# Altium project lps_display_rev_g.PrjPcb
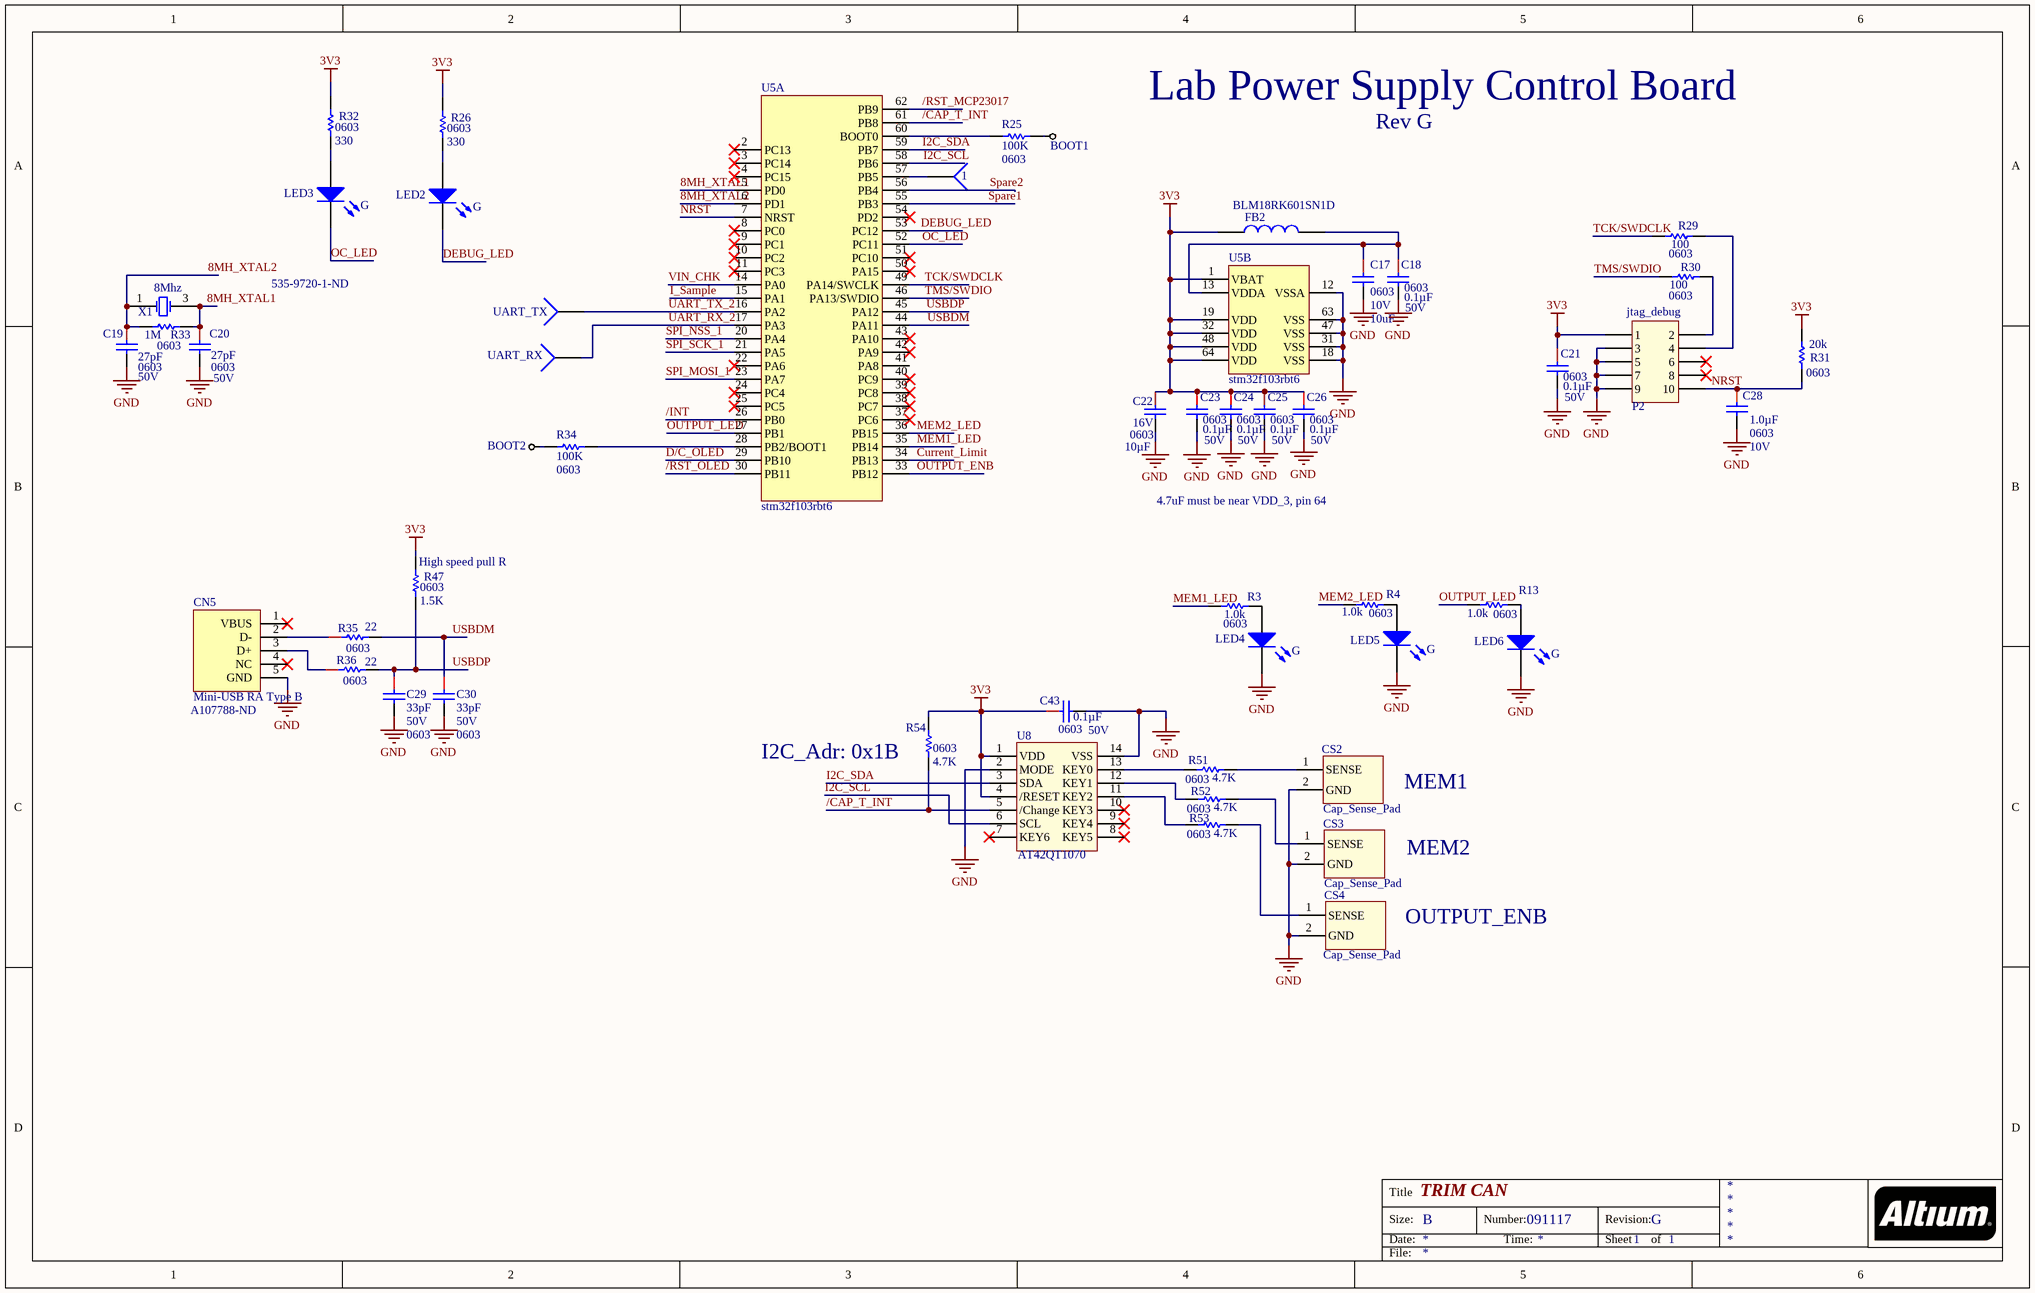
[diagram p0: lps_display_rev_g_p2.SchDoc]
1 sheet, 51 parts. Net scope: global (net labels, ports and power ports of the same name join across sheets).
Board file: lps_display_rev_g.PcbDoc

## Sheet lps_display_rev_g_p2.SchDoc: TRIM CAN
size B; Author: JO; DrawnBy: JO; Engineer: JO; DocumentNumber: 091117; Revision: G; SheetNumber: 1; SheetTotal: 1; PageSetup: Record=PageOptions|CenterHorizontal=True|CenterVertical=True|PrintScale=0.95|XCorrection=1.00|YCorrection=1.00|PrintKind=1|BorderSize=5000000|LeftOffset=0|BottomOffset=0|Orientation=2|PaperLength=1000|PaperWidth=1000|Scale=100|PaperSource=7|PrintQuality=-4|MediaType=1|DitherType=10|PaperKind=Letter|PrintScaleMode=1; DocumentName: TRIM CAN

### Parts
1  (no value)  [TestPoint-TH 35 mil]  (no BOM)
BOOT1  TP  [TestPoint-TH 40 mil]  (value not drawn)
BOOT2  TP  [TestPoint-TH 40 mil]  (value not drawn)
C17  Package / Case: 0603  Voltage - Rated: 10V  Capacitance: 10uF  [CAPC0603(1608)_N]  (hidden comment: CAP 10UF 10V 10% X5R 0603)
C18  Package / Case: 0603  Capacitance: 0.1µF  Voltage - Rated: 50V  [CAPC0603(1608)_N]  (hidden comment: 0.1uF 0603 50V)
C19  Voltage - Rated: 50V  Package / Case: 0603  Capacitance: 27pF  [CAPC0603(1608)_L]  (hidden comment: 27pF 0603)
C20  Voltage - Rated: 50V  Package / Case: 0603  Capacitance: 27pF  [CAPC0603(1608)_L]  (hidden comment: 27pF 0603)
C21  Package / Case: 0603  Capacitance: 0.1µF  Voltage - Rated: 50V  [CAPC0603(1608)_N]  (hidden comment: 0.1uF 0603 50V)
C22  Voltage - Rated: 16V  Package / Case: 0603  Capacitance: 10µF  [CAPC0603(1608)_M]  (hidden comment: 4.7UF 0603)
C23  Package / Case: 0603  Capacitance: 0.1µF  Voltage - Rated: 50V  [CAPC0603(1608)_N]  (hidden comment: 0.1uF 0603 50V)
C24  Package / Case: 0603  Capacitance: 0.1µF  Voltage - Rated: 50V  [CAPC0603(1608)_N]  (hidden comment: 0.1uF 0603 50V)
C25  Package / Case: 0603  Capacitance: 0.1µF  Voltage - Rated: 50V  [CAPC0603(1608)_N]  (hidden comment: 0.1uF 0603 50V)
C26  Package / Case: 0603  Capacitance: 0.1µF  Voltage - Rated: 50V  [CAPC0603(1608)_N]  (hidden comment: 0.1uF 0603 50V)
C28  Capacitance: 1.0µF  Package / Case: 0603  Voltage - Rated: 10V  [CAPC0603(1608)_N]  (hidden comment: 1uF)
C29  33pF  Voltage (Rated): 50V  Package (Imperial): 0603  [CAPC0603(1608)_M]
C30  33pF  Voltage (Rated): 50V  Package (Imperial): 0603  [CAPC0603(1608)_M]
C43  Package / Case: 0603  Capacitance: 0.1µF  Voltage - Rated: 50V  [CAPC0603(1608)_N]  (hidden comment: 0.1uF 0603 50V)
CN5  Mini-USB RA Type B  [USB-MINI-B - 2A]
CS2  Cap_Sense_Pad  [CAP_TOUCH_ROUND]
CS3  Cap_Sense_Pad  [CAP_TOUCH_ROUND]
CS4  Cap_Sense_Pad  [CAP_TOUCH_ROUND]
FB2  BLM18RK601SN1D  [RESC0603(1608)_N]
LED2  G  [SM-LED-0603]
LED3  G  [SM-LED-0603]
LED4  G  [SM-LED-0603]
LED5  G  [SM-LED-0603]
LED6  G  [SM-LED-0603]
P2  jtag_debug  [jtag_debug]
R3  Package / Case: 0603  [RESC0603(1608)_N]  (hidden comment: 1.0K)
R4  Package / Case: 0603  [RESC0603(1608)_N]  (hidden comment: 1.0K)
R13  Package / Case: 0603  [RESC0603(1608)_N]  (hidden comment: 1.0K)
R25  100K  Supplier Device Package: 0603  [RESC0603(1608)_N]
R26  Package / Case: 0603  Resistance (Ohms): 330  [RESC0603(1608)_N]  (hidden comment: 1.0K)
R29  Package / Case: 0603  [RESC0603(1608)_N]  (hidden comment: 100)
R30  Package / Case: 0603  [RESC0603(1608)_N]  (hidden comment: 100)
R31  Resistance (Ohms): 20k  Package / Case: 0603  [RESC0603(1608)_N]  (hidden comment: 10K 1%)
R32  Package / Case: 0603  Resistance (Ohms): 330  [RESC0603(1608)_N]  (hidden comment: 1.0K)
R33  Package / Case: 0603  [RESC0603(1608)_N]  (hidden comment: 1M)
R34  100K  Supplier Device Package: 0603  [RESC0603(1608)_N]
R35  Package (Imperial): 0603  [RESC0603(1608)_M]  (hidden comment: 22)
R36  Package (Imperial): 0603  [RESC0603(1608)_M]  (hidden comment: 22)
R47  Package / Case: 0603  Resistance (Ohms): 1.5K  [RESC0603(1608)_M]  (hidden comment: 1.0K)
R51  Package / Case: 0603  Resistance (Ohms): 4.7K  [RESC0603(1608)_M]  (hidden comment: 1.0K)
R52  Package / Case: 0603  Resistance (Ohms): 4.7K  [RESC0603(1608)_M]  (hidden comment: 1.0K)
R53  Package / Case: 0603  Resistance (Ohms): 4.7K  [RESC0603(1608)_M]  (hidden comment: 1.0K)
R54  Package / Case: 0603  Resistance (Ohms): 4.7K  [RESC0603(1608)_M]  (hidden comment: 1.0K)
U5  stm32f103rbt6  [LQFP64]  (parts A,B of 2)
U8  AT42QT1070  [SOP14]
UART_RX  (no value)  [TestPoint-TH 35 mil]  (no BOM)
UART_TX  (no value)  [TestPoint-TH 35 mil]  (no BOM)
X1  8Mhz  [SMXOSC/5x3.2]

### Nets
3V3: C21.1 C22.1 C23.1 C24.1 C25.1 C26.1 C43.1 FB2.1 P2.1 R26.2 R31.1 R32.2 R47.2 R54.1 U5.1(VBAT) U5.19(VDD) U5.32(VDD) U5.48(VDD) U5.64(VDD) U8.1(VDD) U8.4(/RESET)
GND: C17.2 C18.2 C19.2 C20.2 C21.2 C22.2 C23.2 C24.2 C25.2 C26.2 C28.2 C29.2 C30.2 C43.2 CN5.0(GND) CN5.5(GND) CS2.2(GND) CS3.2(GND) CS4.2(GND) LED4.2 LED5.2 LED6.2 P2.2(3) P2.5 P2.7 P2.9 U5.12(VSSA) U5.18(VSS) U5.31(VSS) U5.47(VSS) U5.63(VSS) U8.2(MODE) U8.14(VSS)
8MH_XTAL1: C20.1 R33.1 U5.5(PD0) X1.3(OSC2)
8MH_XTAL2: C19.1 R33.2 U5.6(PD1) X1.1(OSC1)
/CAP_T_INT: R54.2 U5.61(PB8) U8.5(/Change)
/INT: U5.26(PB0)
/RST_MCP23017: U5.62(PB9)
/RST_OLED: U5.30(PB11)
Current_Limit: U5.34(PB13)
D/C_OLED: U5.29(PB10)
DEBUG_LED: LED2.2 U5.53(PC12)
I2C_SCL: U5.58(PB6) U8.6(SCL)
I2C_SDA: U5.59(PB7) U8.3(SDA)
I_Sample: U5.15(PA1)
MEM1_LED: R3.1 U5.35(PB14)
MEM2_LED: R4.1 U5.36(PB15)
NRST: C28.1 P2.10 R31.2 U5.7(NRST)
OC_LED: LED3.2 U5.52(PC11)
OUTPUT_ENB: U5.33(PB12)
OUTPUT_LED: R13.1 U5.27(PB1)
Spare1: U5.55(PB3)
Spare2: U5.56(PB4)
SPI_MOSI_1: U5.23(PA7)
SPI_NSS_1: U5.20(PA4)
SPI_SCK_1: U5.21(PA5)
TCK/SWDCLK: R29.2 U5.49(PA14/SWCLK)
TMS/SWDIO: R30.2 U5.46(PA13/SWDIO)
UART_RX_2: U5.17(PA3) UART_RX.1
UART_TX_2: U5.16(PA2) UART_TX.1
USBDM: C30.1 R35.2 U5.44(PA11)
USBDP: C29.1 R36.2 R47.1 U5.45(PA12)
VIN_CHK: U5.14(PA0)
Net1_1: 1.1 U5.57(PB5)
NetBOOT1_1: BOOT1.1 R25.1
NetBOOT2_1: BOOT2.1 R34.2
NetC17_1: C17.1 C18.1 FB2.2 U5.13(VDDA)
NetCN5_2: CN5.2(D-) R35.1
NetCN5_3: CN5.3(D+) R36.1
NetCS2_1: CS2.1(SENSE) R51.1
NetCS3_1: CS3.1(SENSE) R52.1
NetCS4_1: CS4.1(SENSE) R53.1
NetLED2_1: LED2.1 R26.1
NetLED3_1: LED3.1 R32.1
NetLED4_1: LED4.1 R3.2
NetLED5_1: LED5.1 R4.2
NetLED6_1: LED6.1 R13.2
NetP2_2: P2.2 R30.1
NetP2_4: P2.4 R29.1
NetR25_2: R25.2 U5.60(BOOT0)
NetR34_1: R34.1 U5.28(PB2/BOOT1)
NetR51_2: R51.2 U8.13(KEY0)
NetR52_2: R52.2 U8.12(KEY1)
NetR53_2: R53.2 U8.11(KEY2)

Not connected (* = marked no-connect by the designer): CN5 1(VBUS)* 4(NC)*; P2 6* 8*; U5 2(PC13)* 3(PC14)* 4(PC15)* 8(PC0)* 9(PC1)* 10(PC2)* 11(PC3)* 22(PA6)* 24(PC4)* 25(PC5)* 37(PC6)* 38(PC7)* 39(PC8)* 40(PC9)* 41(PA8) 42(PA9)* 43(PA10)* 50(PA15)* 51(PC10)* 54(PD2)*; U8 7(KEY6)* 8(KEY5)* 9(KEY4)* 10(KEY3)*; X1 2(NC) 4(NC)

### Notes on the sheet
- Lab Power Supply Control Board
- Rev G
- 535-9720-1-ND
- 4.7uF must be near VDD_3, pin 64
- (near R47) High speed pull R
- (near CN5) A107788-ND
- (near R54) I2C_Adr: 0x1B
- MEM1
- MEM2
- OUTPUT_ENB
- Title
- Size:
- Date:
- B
- Number:
- Time:
- Revision:
- Sheet
- of
- File:

### Library data of the parts
1 UART_RX UART_TX = TestPoint: Test Point
BOOT1 BOOT2 = TestPoint-PC-W: Test Point White; Manufacturer: Keystone Electronics; Manufacturer Part Number: 5002; Plating: Silver; Material - Insulation: Nylon 46, UL 94V-0; Material - Body: Phosphor Bronze; Supplier 1: Digi-Key; RoHS: RoHS Compliant; Category: Test and Measurement; Stock 1: 329102; Pricing 1: 1=0.37, 10=0.316, 50=0.2298, 100=0.2209, 250=0.19832, 1000=0.1616, 2500=0.14424, 5000=0.13523 (USD); Packaging: Bulk; Part Status: Active; Type: PC Test Point, Miniature; Mounting Type: 0.040" (1.02mm) Hole Diameter; Color: White; Size / Dimension: 0.100" Dia x 0.180" L (2.54mm x 4.57mm); Height: -; ComponentLink1URL: http://www.keyelco.com/product-pdf.cfm?p=1311; ComponentLink1Description: http://www.keyelco.com/product-pdf.cfm?p=1311; Supplier Part Number 1: 36-5002-ND
C17 = CAP CER 10UF 10V 10% X5R 0603: 10uF 0603; Manufacturer: Samsung Electro-Mechanics America, Inc; Manufacturer Part Number: CL10A106KP8NNNC; ClassName: *; Supplier 1: Digi-Key; RoHS: RoHS Compliant; Category: Capacitors; Stock 1: 157585; Pricing 1: 1=0.48, 10=0.42, 25=0.3, 100=0.21, 500=0.153, 1000=0.138 (USD); Packaging: Cut Tape (CT); Tolerance: ±10%; Temperature Coefficient: X5R; Mounting Type: Surface Mount, MLCC; Operating Temperature: -55°C ~ 85°C; Applications: General Purpose; Ratings: -; Size / Dimension: 0.063" L x 0.031" W (1.60mm x 0.80mm); Height - Seated (Max): -; Thickness (Max): 0.035" (0.90mm); Lead Spacing: -; Features: -; Lead Style: -; ComponentLink1URL: http://www.samsungsem.com/kr/front/downloadcms.do?path=/kr/support/product-search/mlcc/__icsFiles/afieldfile/2014/11/05&fileName=S_CL10A106KP8NNNC.pdf; ComponentLink1Description: http://www.samsungsem.com/kr/front/downloadcms.do?path=/kr/support/product-search/mlcc/__icsFiles/afieldfile/2014/11/05&fileName=S_CL10A106KP8NNNC.pdf; Supplier Part Number 1: 1276-1192-1-ND
C18 C21 C23-C26 C43 = CAP CER 0.1UF 50V 10% X7R 0603: Manufacturer: Yageo; Manufacturer Part Number: CC0603ZRY5V9BB104; Tolerance: -20%, +80%; Temperature Coefficient: Y5V (F); ClassName: *; Supplier 1: Digi-Key; RoHS: RoHS Compliant; Category: Capacitors; Stock 1: 2192156; Pricing 1: 1=0.1, 10=0.019, 100=0.0087, 500=0.0062, 1000=0.00487 (USD); Packaging: Cut Tape (CT); Part Status: Active; Operating Temperature: -30°C ~ 85°C; Features: -; Ratings: -; Applications: General Purpose; Failure Rate: -; Mounting Type: Surface Mount, MLCC; Size / Dimension: 0.063" L x 0.031" W (1.60mm x 0.80mm); Height - Seated (Max): -; Thickness (Max): 0.035" (0.90mm); Lead Spacing: -; Lead Style: -; ComponentLink1URL: http://www.yageo.com/documents/recent/UPY-GPHC_Y5V_6.3V-to-50V_8.pdf; ComponentLink1Description: http://www.yageo.com/documents/recent/UPY-GPHC_Y5V_6.3V-to-50V_8.pdf; Supplier Part Number 1: 311-1343-1-ND
C19 C20 = CAP CER 27PF 50V 1% NP0 0603: Manufacturer: Kemet; Manufacturer Part Number: C0603C270F5GACTU; Tolerance: ±1%; Temperature Coefficient: C0G, NP0; Supplier 1: Digi-Key; RoHS: RoHS Compliant; Category: Capacitors; Stock 1: 27319; Pricing 1: 1=0.94, 10=0.795, 25=0.6596, 50=0.5848, 100=0.4648, 250=0.38984, 1000=0.31605 (USD); Packaging: Cut Tape (CT); Mounting Type: Surface Mount, MLCC; Operating Temperature: -55°C ~ 125°C; Applications: General Purpose; Ratings: -; Size / Dimension: 0.063" L x 0.031" W (1.60mm x 0.80mm); Height - Seated (Max): -; Thickness (Max): 0.034" (0.87mm); Lead Spacing: -; Features: -; Lead Style: -; ComponentLink1URL: http://www.kemet.com/docfinder?Partnumber=C0603C270F5GACTU; ComponentLink1Description: http://www.kemet.com/docfinder?Partnumber=C0603C270F5GACTU; Supplier Part Number 1: 399-7888-1-ND
C22 = CAP CER 4.7UF 16V 10% X5R 0603: Manufacturer: Taiyo Yuden; Manufacturer Part Number: EMK107ABJ475KA-T; Tolerance: ±10%; Temperature Coefficient: X5R; ClassName: *; Supplier 1: Digi-Key; RoHS: RoHS Compliant; Category: Capacitors; Stock 1: 498907; Pricing 1: 1=0.26, 10=0.216, 50=0.1216, 100=0.108, 250=0.081, 500=0.07154, 1000=0.06345 (USD); Packaging: Cut Tape (CT); Mounting Type: Surface Mount, MLCC; Operating Temperature: -55°C ~ 85°C; Applications: General Purpose; Ratings: -; Size / Dimension: 0.063" L x 0.031" W (1.60mm x 0.80mm); Height - Seated (Max): -; Thickness (Max): 0.035" (0.90mm); Lead Spacing: -; Features: -; Lead Style: -; ComponentLink1URL: http://www.yuden.co.jp/or/product/category/capacitor/EMK107ABJ475KA-T.pdf; ComponentLink1Description: http://www.yuden.co.jp/or/product/category/capacitor/EMK107ABJ475KA-T.pdf; Supplier Part Number 1: 587-2786-1-ND
C28 = CAP CER 1UF 10V 10% X5R 0603: 1uF 0603 10V; Manufacturer: Kemet; Manufacturer Part Number: C0603C105K8PACTU; Tolerance: ±10%; Temperature Coefficient: X5R; Supplier 1: Digi-Key; RoHS: RoHS Compliant; Category: Capacitors; Stock 1: 1121198; Pricing 1: 1=0.1, 10=0.043, 25=0.0304, 50=0.0232, 100=0.0196, 250=0.01608, 1000=0.0105 (USD); Packaging: Cut Tape (CT); Mounting Type: Surface Mount, MLCC; Operating Temperature: -55°C ~ 85°C; Applications: General Purpose; Ratings: -; Size / Dimension: 0.063" L x 0.031" W (1.60mm x 0.80mm); Height - Seated (Max): -; Thickness (Max): 0.035" (0.90mm); Lead Spacing: -; Features: -; Lead Style: -; ComponentLink1URL: http://www.kemet.com/datasheets&C0603C105K8PACTU; ComponentLink1Description: http://www.kemet.com/datasheets&C0603C105K8PACTU; Supplier Part Number 1: 399-3118-1-ND
C29 C30 = CMP-007-0143-08: CAP CER 33PF 50V 5% NP0 0603; Dielectric Material: Ceramic; Package (Metric): 1608; Temperature Coefficient: C0G, NP0; Tolerance: 5%; Mounting Type: SMD; Capacitance: 33pF
CN5 = CMP-001-0449-01: Mini-USB RA Type B 2A; Manufacturer Part Number: 54-00019; Manufacturer: Tensility International Corp; Mating Cycles: 5000; Gender: Receptacle; Number of Contacts: 5; Number of Ports: 1; Voltage - Rated: 30VDC; Connector Type: USB - mini B; Shielding: Unshielded; Features: Board Guide; ComponentLink1Description: http://www.tensility.com/pdffiles/54-00019.pdf; Component Name: Mini-USB RA Type B 2A 54-00019; RoHS: RoHS Compliant; Designator: Mini-USB RA Type B 2A 54-00019; Mounting Type: Through Hole, Right Angle; Operating Temperature: -10°C ~ 60°C; Pin Count: 6; Mounting Feature: Horizontal; Supplier Link 2: https://www.arrow.com/en/products/54-00019/tensility-international; Ingress Protection: -; Contact Finish: Gold; Insulation Color: Black; Current Rating: 2A; Pricing 1: 50=0.6202 (USD); Stock 1: 0; Specifications: -; Termination: Solder; Packaging: Tube; Material Flammability Rating: -; Part Status: Active; Shell/Shielding Material: Phosphor Bronze; ComponentLink1URL: http://www.tensility.com/pdffiles/54-00019.pdf
FB2 = FERRITE BEAD 120 OHM 0603 1LN: FERRITE 120 OHM 0603 500mA; Manufacturer: TDK Corporation; Manufacturer Part Number: MMZ1608R121ATA00; Filter Type: Signal Line; Number of Lines: 1; Impedance @ Frequency: 120 Ohm @ 100MHz; DC Resistance (DCR) (Max): 180 mOhm; ClassName: *; Creator: *; Supplier 1: Digi-Key; RoHS: RoHS Compliant; Category: Filters; Stock 1: 21122; Pricing 1: 1=0.1, 10=0.073, 100=0.0436, 250=0.03168, 500=0.02904, 1000=0.02508 (USD); Packaging: Cut Tape (CT); Part Status: Active; Current Rating (Max): 500mA; Ratings: -; Operating Temperature: -55°C ~ 125°C; Package / Case: 0603 (1608 Metric); Mounting Type: Surface Mount; Height (Max): 0.037" (0.95mm); Size / Dimension: 0.063" L x 0.031" W (1.60mm x 0.80mm); ComponentLink1URL: https://product.tdk.com/info/en/catalog/datasheets/beads_commercial_signal_mmz1608_en.pdf; ComponentLink1Description: https://product.tdk.com/info/en/catalog/datasheets/beads_commercial_signal_mmz1608_en.pdf; Supplier Part Number 1: 445-2170-1-ND
LED2-LED6 = 0603 LED: 0603 SMD LED; PN: P11500CT-ND; Vendor: Digikey
R3 R4 R13 R26 R32 R47 R51-R54 = RES 1K OHM 1% 1/10W 0603: 1.0K 0603; Manufacturer: Stackpole Electronics Inc.; Manufacturer Part Number: RMCF0603FT1K00; Tolerance: ±1%; Power (Watts): 0.1W, 1/10W; Temperature Coefficient: ±100ppm/°C; Supplier 1: Digi-Key; RoHS: RoHS Compliant; Category: Resistors; Stock 1: 411308; Pricing 1: 1=0.1, 10=0.02, 100=0.0081, 1000=0.00364, 2500=0.00316 (USD); Packaging: Cut Tape (CT); Part Status: Active; Composition: Thick Film; Features: Automotive AEC-Q200; Operating Temperature: -55°C ~ 155°C; Size / Dimension: 0.061" L x 0.031" W (1.55mm x 0.80mm); Height - Seated (Max): 0.022" (0.55mm); Failure Rate: -; ComponentLink1URL: https://www.seielect.com/Catalog/SEI-RMCF_RMCP.pdf; ComponentLink1Description: https://www.seielect.com/Catalog/SEI-RMCF_RMCP.pdf; Supplier Part Number 1: RMCF0603FT1K00CT-ND; Supplier Device Package: 0603
  R3 R4 R13: Resistance (Ohms): 1.0k
R25 R34 = RES 100K OHM 1% 1/10W 0603: 100K 0603; Manufacturer: Yageo; Manufacturer Part Number: RC0603FR-07100KL; Tolerance: ±1%; Power (Watts): 0.1W, 1/10W; Temperature Coefficient: ±100ppm/°C; Supplier 1: Digi-Key; RoHS: RoHS Compliant; Category: Resistors; Stock 1: 13526613; Pricing 1: 1=0.1, 10=0.015, 100=0.006, 1000=0.00268, 2500=0.00233 (USD); Packaging: Cut Tape (CT); Part Status: Active; Composition: Thick Film; Features: Moisture Resistant; Operating Temperature: -55°C ~ 155°C; Package / Case: 0603 (1608 Metric); Size / Dimension: 0.063" L x 0.032" W (1.60mm x 0.80mm); Height - Seated (Max): 0.022" (0.55mm); Failure Rate: -; ComponentLink1URL: http://www.yageo.com/documents/recent/PYu-RC_Group_51_RoHS_L_8.pdf; ComponentLink1Description: http://www.yageo.com/documents/recent/PYu-RC_Group_51_RoHS_L_8.pdf; Supplier Part Number 1: 311-100KHRCT-ND
R29 R30 = RES 100 OHM 1% 1/10W 0603 2017: 100 0603; Manufacturer: Vishay Dale; Manufacturer Part Number: CRCW0603100RFKEC; Tolerance: ±1%; Power (Watts): 0.1W, 1/10W; Temperature Coefficient: ±100ppm/°C; Supplier 1: Digi-Key; RoHS: RoHS Compliant; Category: Resistors; Stock 1: 25979; Pricing 1: 1=0.1, 10=0.033, 100=0.0136, 1000=0.00609, 2500=0.00529, 5000=0.00437 (USD); Packaging: Cut Tape (CT); Part Status: Active; Resistance (Ohms): 100; Composition: Thick Film; Features: Automotive AEC-Q200; Operating Temperature: -55°C ~ 155°C; Supplier Device Package: 0603; Size / Dimension: 0.063" L x 0.033" W (1.60mm x 0.85mm); Height - Seated (Max): 0.020" (0.50mm); Failure Rate: -; ComponentLink1URL: http://www.vishay.com/docs/20035/dcrcwe3.pdf; ComponentLink1Description: http://www.vishay.com/docs/20035/dcrcwe3.pdf; Supplier Part Number 1: 541-2975-1-ND
R31 = RES 10K OHM 1/10W 1% 0603 SMD: 10K 0603; Manufacturer: Panasonic Electronic Components; Manufacturer Part Number: ERJ-3EKF1002V; Power (Watts): 0.1W, 1/10W; Temperature Coefficient: ±100ppm/°C; Category: Resistors; Supplier 1: Digi-Key; RoHS: RoHS Compliant; Stock 1: 5046430; Pricing 1: 1=0.1, 50=0.015, 100=0.0114, 250=0.00844, 500=0.00624, 1000=0.00416, 2500=0.00351 (USD); Packaging: Cut Tape (CT); Tolerance: ±1%; Composition: Thick Film; Features: -; Supplier Device Package: 0603; Size / Dimension: 0.063" L x 0.031" W (1.60mm x 0.80mm); Height: 0.022" (0.55mm); Number of Terminations: 2; ComponentLink1URL: http://industrial.panasonic.com/www-cgi/jvcr13pz.cgi?E+PZ+3+AOA0002+ERJ3EKF1002V+7+WW; ComponentLink1Description: http://industrial.panasonic.com/www-cgi/jvcr13pz.cgi?E+PZ+3+AOA0002+ERJ3EKF1002V+7+WW; Supplier Part Number 1: P10.0KHCT-ND
R33 = RES 1M OHM 1/10W 1% 0603: 1M 0603; Manufacturer: Yageo; Manufacturer Part Number: RC0603FR-071ML; Voltage Rating: 50V; Tolerance: ±1%; Power Rating: 100mW; Temperature Coefficient: 100ppm/°C; ComponentLink1URL: http://industrial.panasonic.com/www-cgi/jvcr13pz.cgi?E+PZ+3+AOA0002+ERJ3EKF1004V+7+WW; ComponentLink1Description: http://industrial.panasonic.com/www-cgi/jvcr13pz.cgi?E+PZ+3+AOA0002+ERJ3EKF1004V+7+WW; ComponentLink2URL: https://datasheet.ciiva.com/12555/rc0603-272842-12555388.pdf; ComponentLink2Description: https://datasheet.ciiva.com/12555/rc0603-272842-12555388.pdf; ComponentLink3URL: https://datasheet.ciiva.com/7983/443971-7983614.pdf; ComponentLink3Description: https://datasheet.ciiva.com/7983/443971-7983614.pdf; ComponentLink4URL: https://datasheet.ciiva.com/11819/0900766b80f96399-11819295.pdf; ComponentLink4Description: https://datasheet.ciiva.com/11819/0900766b80f96399-11819295.pdf; Supplier 1: Digi-Key; Supplier Part Number 1: 311-1.00MHRCT-ND; Stock 1: 2416528; Pricing 1: 1=0.1, 10=0.015, 100=0.006, 1000=0.0027, 2500=0.0023 (USD); Case/Package: 0603; Number of Pins: 2; Case Code (Imperial): 0603; Case Code (Metric): 1608; Min Operating Temperature: -55°C; Max Operating Temperature: 155°C; Resistance: 1M; Packaging: Tape and Reel; Package Quantity: 5000; Termination: SMD/SMT; Composition: Thick Film; Military Standard: Not; Length: 1.6mm; Height: 0.45mm; Width: 0.8mm; Depth: 0.8mm; REACH SVHC: No SVHC; Lead Free: Lead Free; Category: Resistors; Resistance (Ohms): 1M
R35 R36 = CMP-001-0711-04: Res Thick Film 0603 22 Ohm 5% 1/10W ±100ppm/C Molded SMD Paper T/R; Max Power Dissipation: 100mW; Package (Metric): 1608; Temperature Coefficient: 100ppm/°C; Power Rating: 100mW; Mount: Surface Mount; Termination: SMD/SMT; Power: 100mW; Height: 550µm; Length: 1.55mm; Min Operating Temperature: -55°C; Resistance: 22; Width: 800µm; Tolerance: 5%; Max Operating Temperature: 155°C
U8 = AT42QT1070: QTouch IC
X1 = CRYSTAL 8MHZ ABM3: 8Mhz ABM3 Parallel Load Crystal; Manufacturer: Abracon Corporation; Manufacturer Part Number: ABM3B-8.000MHZ-B2-T; Frequency Stability: ±50ppm; Frequency Tolerance: ±20ppm; Load Capacitance: 18pF; ESR (Equivalent Series Resistance): 200 Ohm; Operating Mode: Fundamental; ClassName: Master Clock; Supplier 1: Digi-Key; RoHS: RoHS Compliant; Category: Crystals and Oscillators; Stock 1: 22545; Pricing 1: 1=1.04, 10=0.92, 50=0.8588, 100=0.76, 500=0.7182 (USD); Packaging: Cut Tape (CT); Type: MHz Crystal; Frequency: 8MHz; Operating Temperature: -20°C ~ 70°C; Ratings: -; Mounting Type: Surface Mount; Package / Case: 4-SMD, No Lead (DFN, LCC); Size / Dimension: 0.197" L x 0.126" W (5.00mm x 3.20mm); Height: 0.043" (1.10mm); ComponentLink1URL: http://www.abracon.com/Resonators/abm3b.pdf; ComponentLink1Description: http://www.abracon.com/Resonators/abm3b.pdf; Supplier Part Number 1: 535-9720-1-ND